# EAGLE design Board_1 (EAGLE 8.7.0)

## Sheet 1 of 3
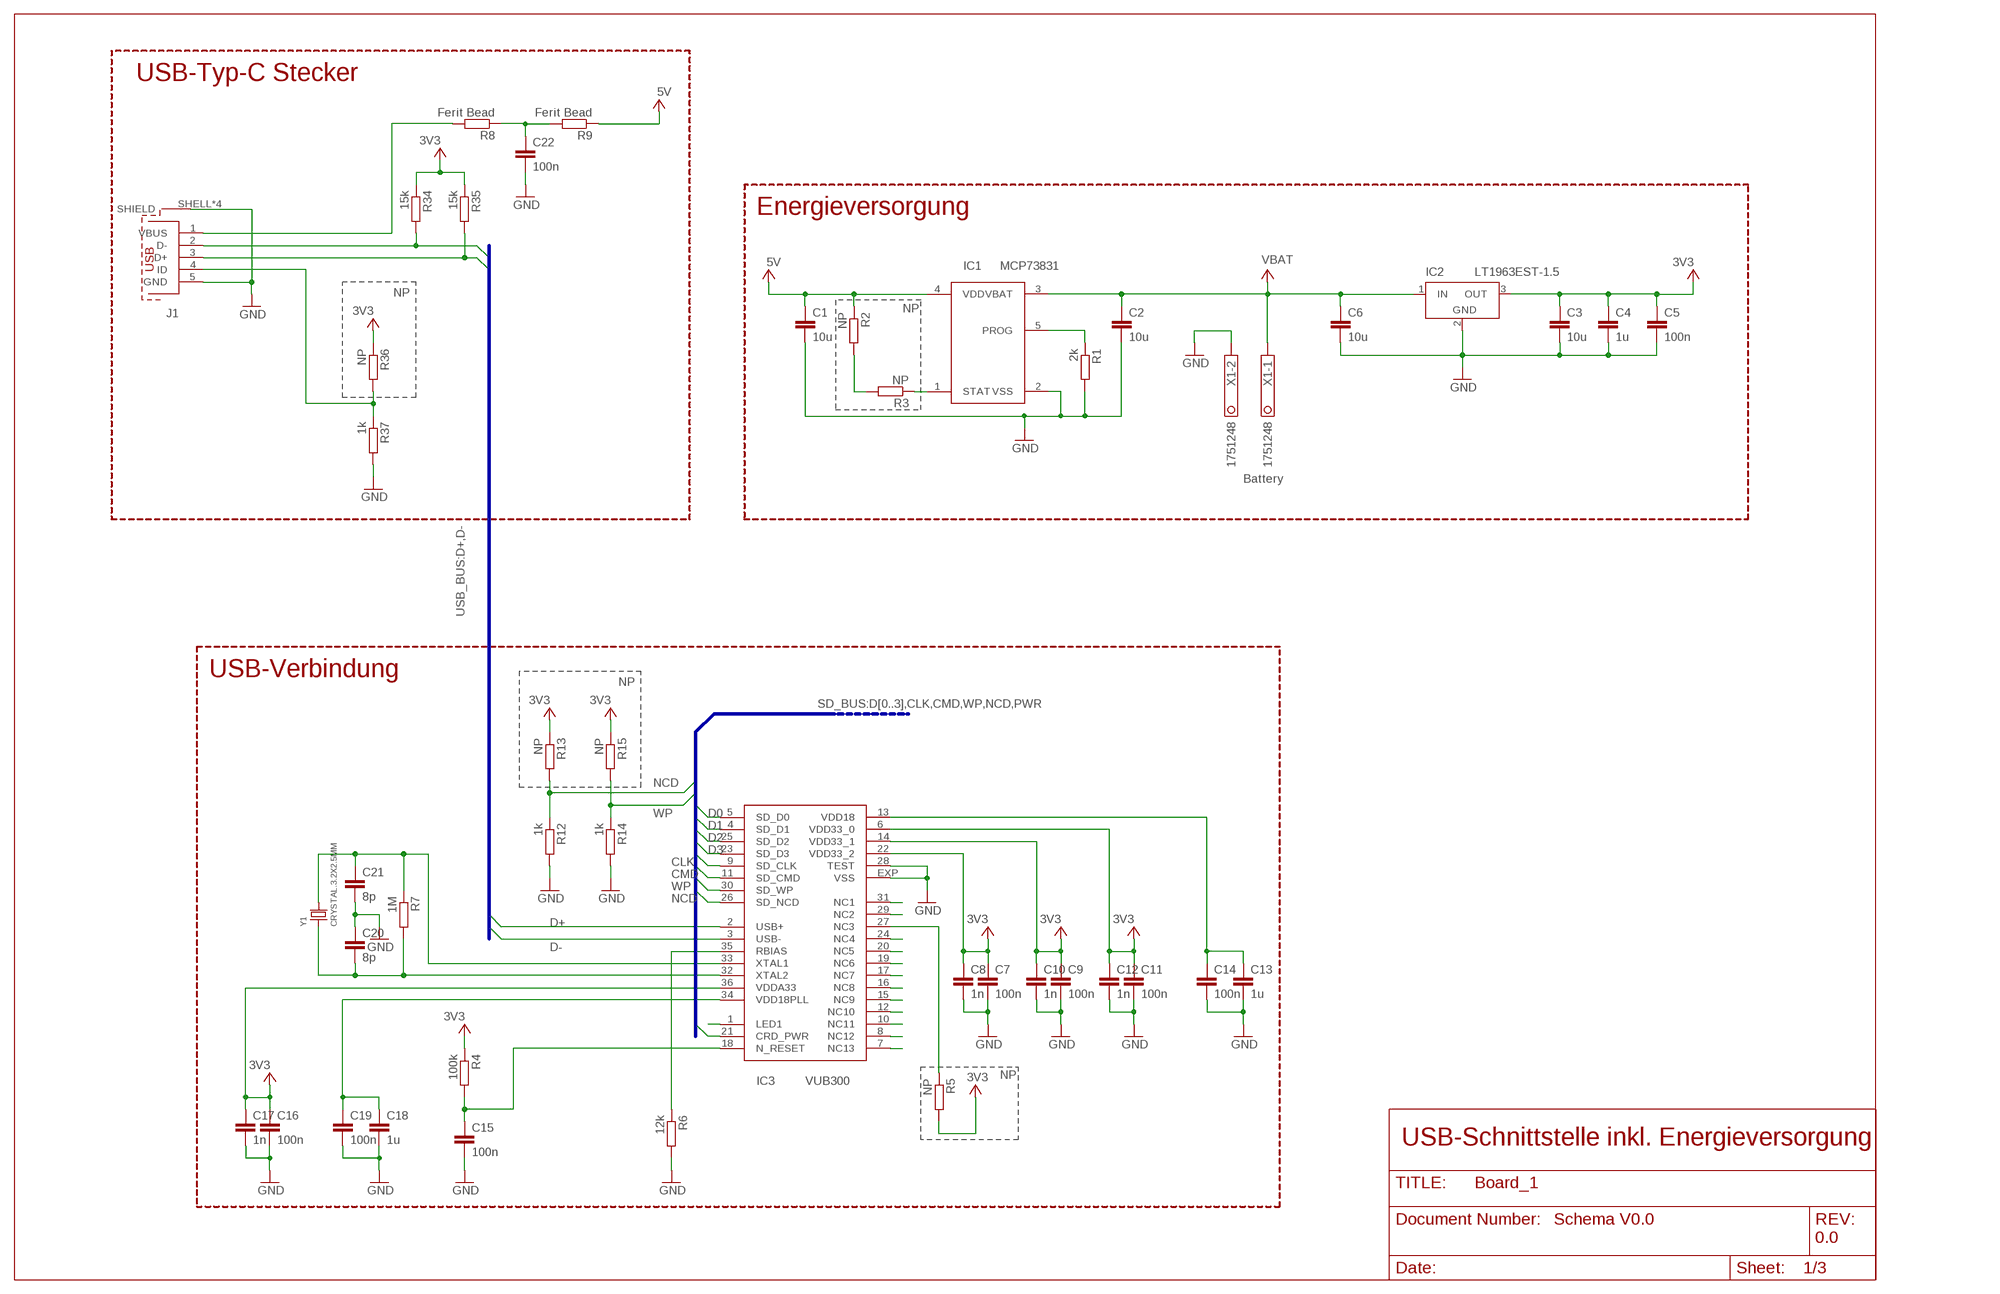
[diagram p0: schematic, sheet 1]

### Parts
C1  10u  C-EUC0805  [C0805]
C2  10u  C-EUC0805  [C0805]
C3  10u  C-EUC0805  [C0805]
C4  1u  C-EUC0603  [C0603]
C5  100n  C-EUC0603  [C0603]
C6  10u  C-EUC0805  [C0805]
C7  100n  C-EUC0402  [C0402]
C8  1n  C-EUC0402  [C0402]
C9  100n  C-EUC0402  [C0402]
C10  1n  C-EUC0402  [C0402]
C11  100n  C-EUC0402  [C0402]
C12  1n  C-EUC0402  [C0402]
C13  1u  C-EUC0402  [C0402]
C14  100n  C-EUC0402  [C0402]
C15  100n  C-EUC0402  [C0402]
C16  100n  C-EUC0402  [C0402]
C17  1n  C-EUC0402  [C0402]
C18  1u  C-EUC0402  [C0402]
C19  100n  C-EUC0402  [C0402]
C20  8p  C-EUC0402  [C0402]
C21  8p  C-EUC0402  [C0402]
C22  100n  C-EUC0603  [C0603]
IC1  MCP73831  [SOT23-5]
IC2  LT1963EST-1.5  [SOT223]
IC3  VUB300  [QFN36-6X6]
J1  629105136821  [629105136821]
R1  2k  R-EU_R0603  [R0603]
R2  NP  R-EU_R0603  [R0603]
R3  NP  R-EU_R0603  [R0603]
R4  100k  R-EU_R0402  [R0402]
R5  NP  R-EU_R0402  [R0402]
R6  12k  R-EU_R0402  [R0402]
R7  1M  R-EU_R0402  [R0402]
R8  Ferit Bead  R-EU_R0603  [R0603]
R9  Ferit Bead  R-EU_R0603  [R0603]
R12  1k  R-EU_R0603  [R0603]
R13  NP  R-EU_R0603  [R0603]
R14  1k  R-EU_R0603  [R0603]
R15  NP  R-EU_R0603  [R0603]
R34  15k  R-EU_R0402  [R0402]
R35  15k  R-EU_R0402  [R0402]
R36  NP  R-EU_R0603  [R0603]
R37  1k  R-EU_R0603  [R0603]
X1  1751248  [1751248]
Y1  CRYSTAL.3.2X2.5MM  [3.2X2.5MM]

### Nets
+3V3: C3.1 C4.1 C5.1 C7.1 C8.1 C9.1 C10.1 C11.1 C12.1 C16.1 C17.1 IC2.3(OUT) IC3.6(VDD33_0) IC3.14(VDD33_1) IC3.22(VDD33_2) IC3.36(VDDA33) R4.1 R5.2 R13.1 R15.1 R34.1 R35.1 R36.1 ; supply symbol labelled 3V3 ; also sheet 2,3
+5V: C1.1 IC1.4(VDD) R2.1 R9.1 ; supply symbol labelled 5V
CLK: IC3.9(SD_CLK) ; also sheet 2
CMD: IC3.11(SD_CMD) ; also sheet 2
D0: IC3.5(SD_D0) ; also sheet 2
D1: IC3.4(SD_D1) ; also sheet 2
D2: IC3.25(SD_D2) ; also sheet 2
D3: IC3.23(SD_D3) ; also sheet 2
D+: IC3.2(USB+) J1.3(D+) R35.2
D-: IC3.3(USB-) J1.2(D-) R34.2
GND: C1.2 C2.2 C3.2 C4.2 C5.2 C6.2 C7.2 C8.2 C9.2 C10.2 C11.2 C12.2 C13.2 C14.2 C15.2 C16.2 C17.2 C18.2 C19.2 C20.1 C21.2 C22.2 IC1.2(VSS) IC2.2(GND) IC3.28(TEST) IC3.EXP(VSS) J1.5(GND) J1.SHELL1(SHIELD) J1.SHELL2(SHIELD) J1.SHELL3(SHIELD) J1.SHELL(SHIELD) R1.2 R6.2 R12.2 R14.2 R37.2 X1.2 ; also sheet 2,3
N$1: IC1.5(PROG) R1.1
N$2: R2.2 R3.2
N$3: IC1.1(STAT) R3.1
N$4: IC3.1(LED1)
N$5: J1.4(ID) R36.2 R37.1
N$19: IC3.8(NC12)
N$20: IC3.7(NC13)
N$21: IC3.10(NC11)
N$22: IC3.12(NC10)
N$23: IC3.24(NC4)
N$24: IC3.15(NC9)
N$25: IC3.16(NC8)
N$26: IC3.17(NC7)
N$27: C15.1 IC3.18(N_RESET) R4.2
N$28: IC3.27(NC3) R5.1
N$29: IC3.19(NC6)
N$30: IC3.20(NC5)
N$31: IC3.35(RBIAS) R6.1
N$32: IC3.29(NC2)
N$33: IC3.31(NC1)
N$34: J1.1(VBUS) R8.2
N$35: C20.2 IC3.32(XTAL2) R7.2 Y1.1
N$36: C21.1 IC3.33(XTAL1) R7.1 Y1.3
N$37: C22.1 R8.1 R9.2
NCD: IC3.26(SD_NCD) R12.1 R13.2
PWR: IC3.21(CRD_PWR) ; also sheet 2
V+: C2.1 C6.1 IC1.3(VBAT) IC2.1(IN) X1.1 ; supply symbol labelled VBAT ; also sheet 3
VDD18: C13.1 C14.1 IC3.13(VDD18)
VDD18PLL: C18.1 C19.1 IC3.34(VDD18PLL)
WP: IC3.30(SD_WP) R14.1 R15.2

### Buses
SD_BUS:D[0..3],CLK,CMD,WP,NCD,PWR
USB_BUS:D+,D-

### Notes on the sheet
- USB-Typ-C Stecker
- Energieversorgung
- NP
- NP
- Battery
- USB-Verbindung | NP
- NP
- USB-Schnittstelle inkl. Energieversorgung
- Schema V0.0
- 0.0

## Sheet 2 of 3
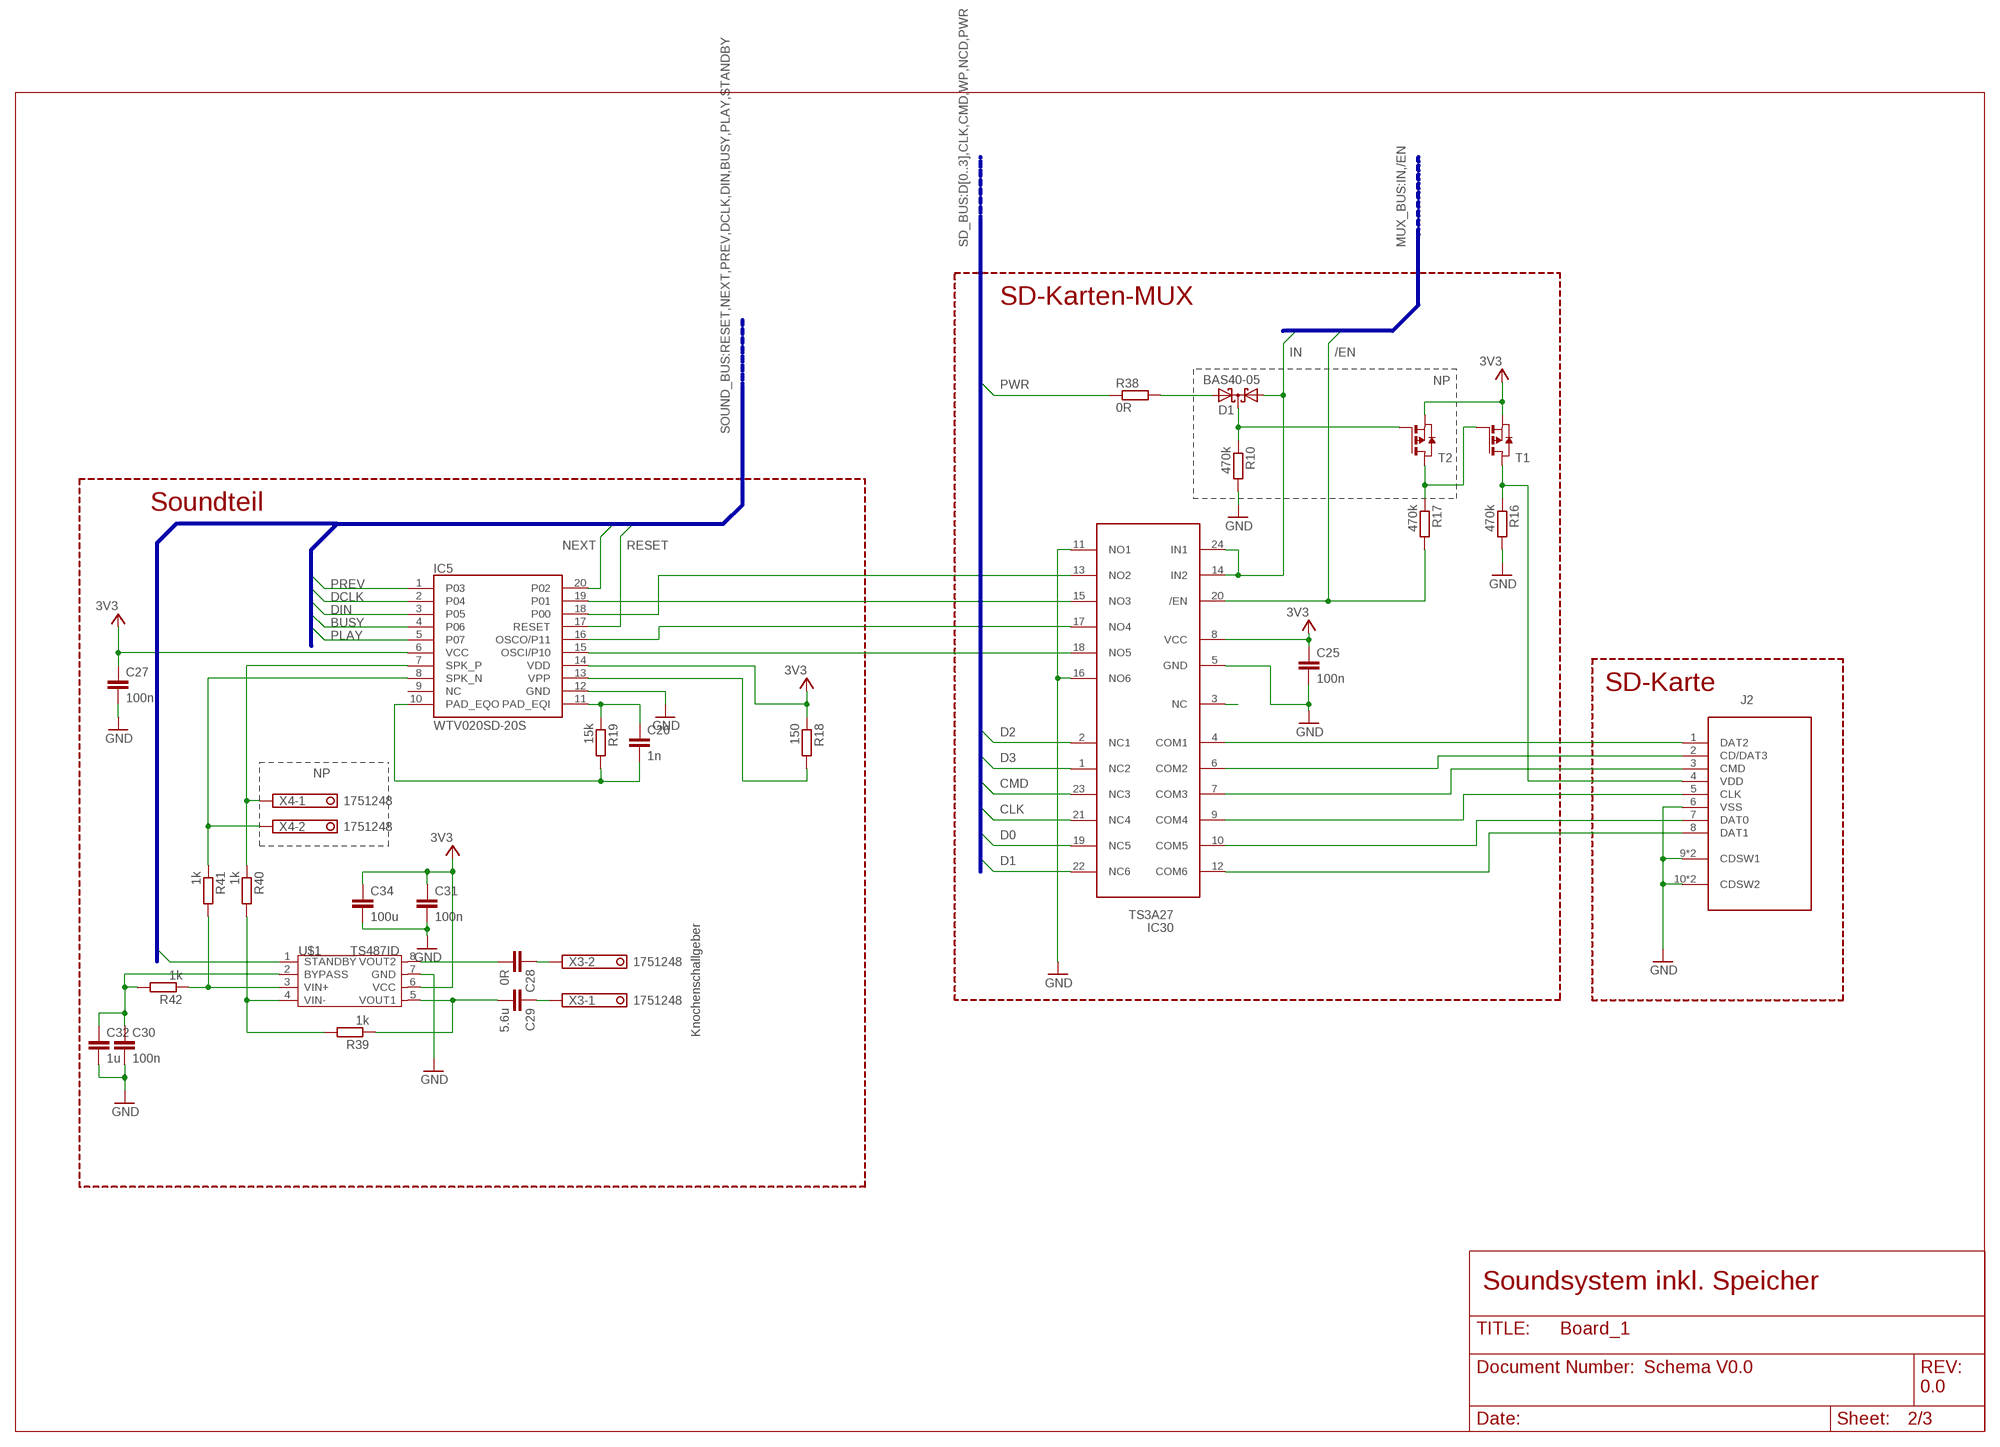
[diagram p1: schematic, sheet 2]

### Parts
C25  100n  C-EUC0603  [C0603]
C26  1n  C-EUC0603  [C0603]
C27  100n  C-EUC0603  [C0603]
C28  0R  C-EUC0603  [C0603]
C29  5.6u  C-EUC0603  [C0603]
C30  100n  C-EUC0603  [C0603]
C31  100n  C-EUC0603  [C0603]
C32  1u  C-EUC0805K  [C0805K]
C34  100u  C-EUC1206  [C1206]
D1  BAS40-05  [SOT23]
IC5  WTV020SD-20S  WTV020SD  [SSOP_20]
IC30  TS3A27  [TSSOP24]
J2  693071010811  [693071010811]
R10  470k  R-EU_R0603  [R0603]
R16  470k  R-EU_R0603  [R0603]
R17  470k  R-EU_R0603  [R0603]
R18  150  R-EU_R0603  [R0603]
R19  15k  R-EU_R0603  [R0603]
R38  0R  R-EU_MELF0102W  [MINI_MELF-0102W]
R39  1k  R-EU_R0603  [R0603]
R40  1k  R-EU_R0603  [R0603]
R41  1k  R-EU_R0603  [R0603]
R42  1k  R-EU_R0603  [R0603]
T1  PMOSSOT23  [SOT-23]
T2  PMOSSOT23  [SOT-23]
U$1  TS487ID  TS4890D  [SO08-6.0]
X3  1751248  [1751248]
X4  1751248  [1751248]

### Nets
+3V3: C25.1 C27.1 C31.1 C34.1 IC5.6(VCC) IC5.14(VDD) IC30.8(VCC) R18.1 T1.2(S) T2.2(S) U$1.6(VCC) ; supply symbol labelled 3V3 ; also sheet 1,3
/EN: IC30.20(/EN) R17.2 ; also sheet 3
BUSY: IC5.4(P06) ; also sheet 3
CLK: IC30.21(NC4) ; also sheet 1
CMD: IC30.23(NC3) ; also sheet 1
D0: IC30.19(NC5) ; also sheet 1
D1: IC30.22(NC6) ; also sheet 1
D2: IC30.2(NC1) ; also sheet 1
D3: IC30.1(NC2) ; also sheet 1
DCLK: IC5.2(P04) ; also sheet 3
DIN: IC5.3(P05) ; also sheet 3
GND: C25.2 C27.2 C30.2 C31.2 C32.2 C34.2 IC5.12(GND) IC30.5(GND) IC30.11(NO1) IC30.16(NO6) J2.6(VSS) J2.9(CDSW1) J2.9-1(CDSW1) J2.10(CDSW2) J2.10-1(CDSW2) R10.2 R16.2 U$1.7(GND) ; also sheet 1,3
IN: D1.1(A1) IC30.14(IN2) IC30.24(IN1) ; also sheet 3
N$8: D1.2(A2) R38.2
N$9: IC5.19(P01) IC30.15(NO3)
N$10: C28.1 X3.2
N$11: C28.2 U$1.8(VOUT2)
N$12: C29.2 R39.1 U$1.5(VOUT1)
N$13: C30.1 C32.1 R42.2 U$1.2(BYPASS)
N$14: R39.2 R40.2 U$1.4(VIN-)
N$15: R41.2 R42.1 U$1.3(VIN+)
N$16: C29.1 X3.1
N$38: IC30.9(COM4) J2.5(CLK)
N$39: IC5.13(VPP) R18.2
N$40: C26.1 IC5.11(PAD_EQI) R19.1
N$41: IC5.16(OSCO/P11) IC30.17(NO4)
N$42: IC5.15(OSCI/P10) IC30.18(NO5)
N$43: IC30.4(COM1) J2.1(DAT2)
N$44: IC30.12(COM6) J2.8(DAT1)
N$45: IC30.6(COM2) J2.2(CD/DAT3)
N$46: R17.1 T1.3(G) T2.1(D)
N$47: IC30.3(NC)
N$49: D1.3(C) R10.1 T2.3(G)
NCD1: J2.4(VDD) R16.1 T1.1(D)
NEXT: IC5.20(P02) ; also sheet 3
PLAY: IC5.5(P07) ; also sheet 3
PREV: IC5.1(P03) ; also sheet 3
PWM: C26.2 IC5.10(PAD_EQO) R19.2
PWR: R38.1 ; also sheet 1
RESET: IC5.17(RESET) ; also sheet 3
SDCS: IC5.18(P00) IC30.13(NO2)
SDDI: IC30.7(COM3) J2.3(CMD)
SDDO: IC30.10(COM5) J2.7(DAT0)
SPK+: IC5.7(SPK_P) R40.1 X4.1
SPK-: IC5.8(SPK_N) R41.1 X4.2
STANDBY: U$1.1(!STANDBY) ; also sheet 3
Unconnected: IC5.9(NC)

### Buses
SD_BUS:D[0..3],CLK,CMD,WP,NCD,PWR
MUX_BUS:IN,/EN
SOUND_BUS:RESET,NEXT,PREV,DCLK,DIN,BUSY,PLAY,STANDBY

### Notes on the sheet
- SD-Karten-MUX
- NP
- Soundteil
- SD-Karte
- NP
- Knochenschallgeber
- Soundsystem inkl. Speicher
- Schema V0.0
- 0.0

## Sheet 3 of 3
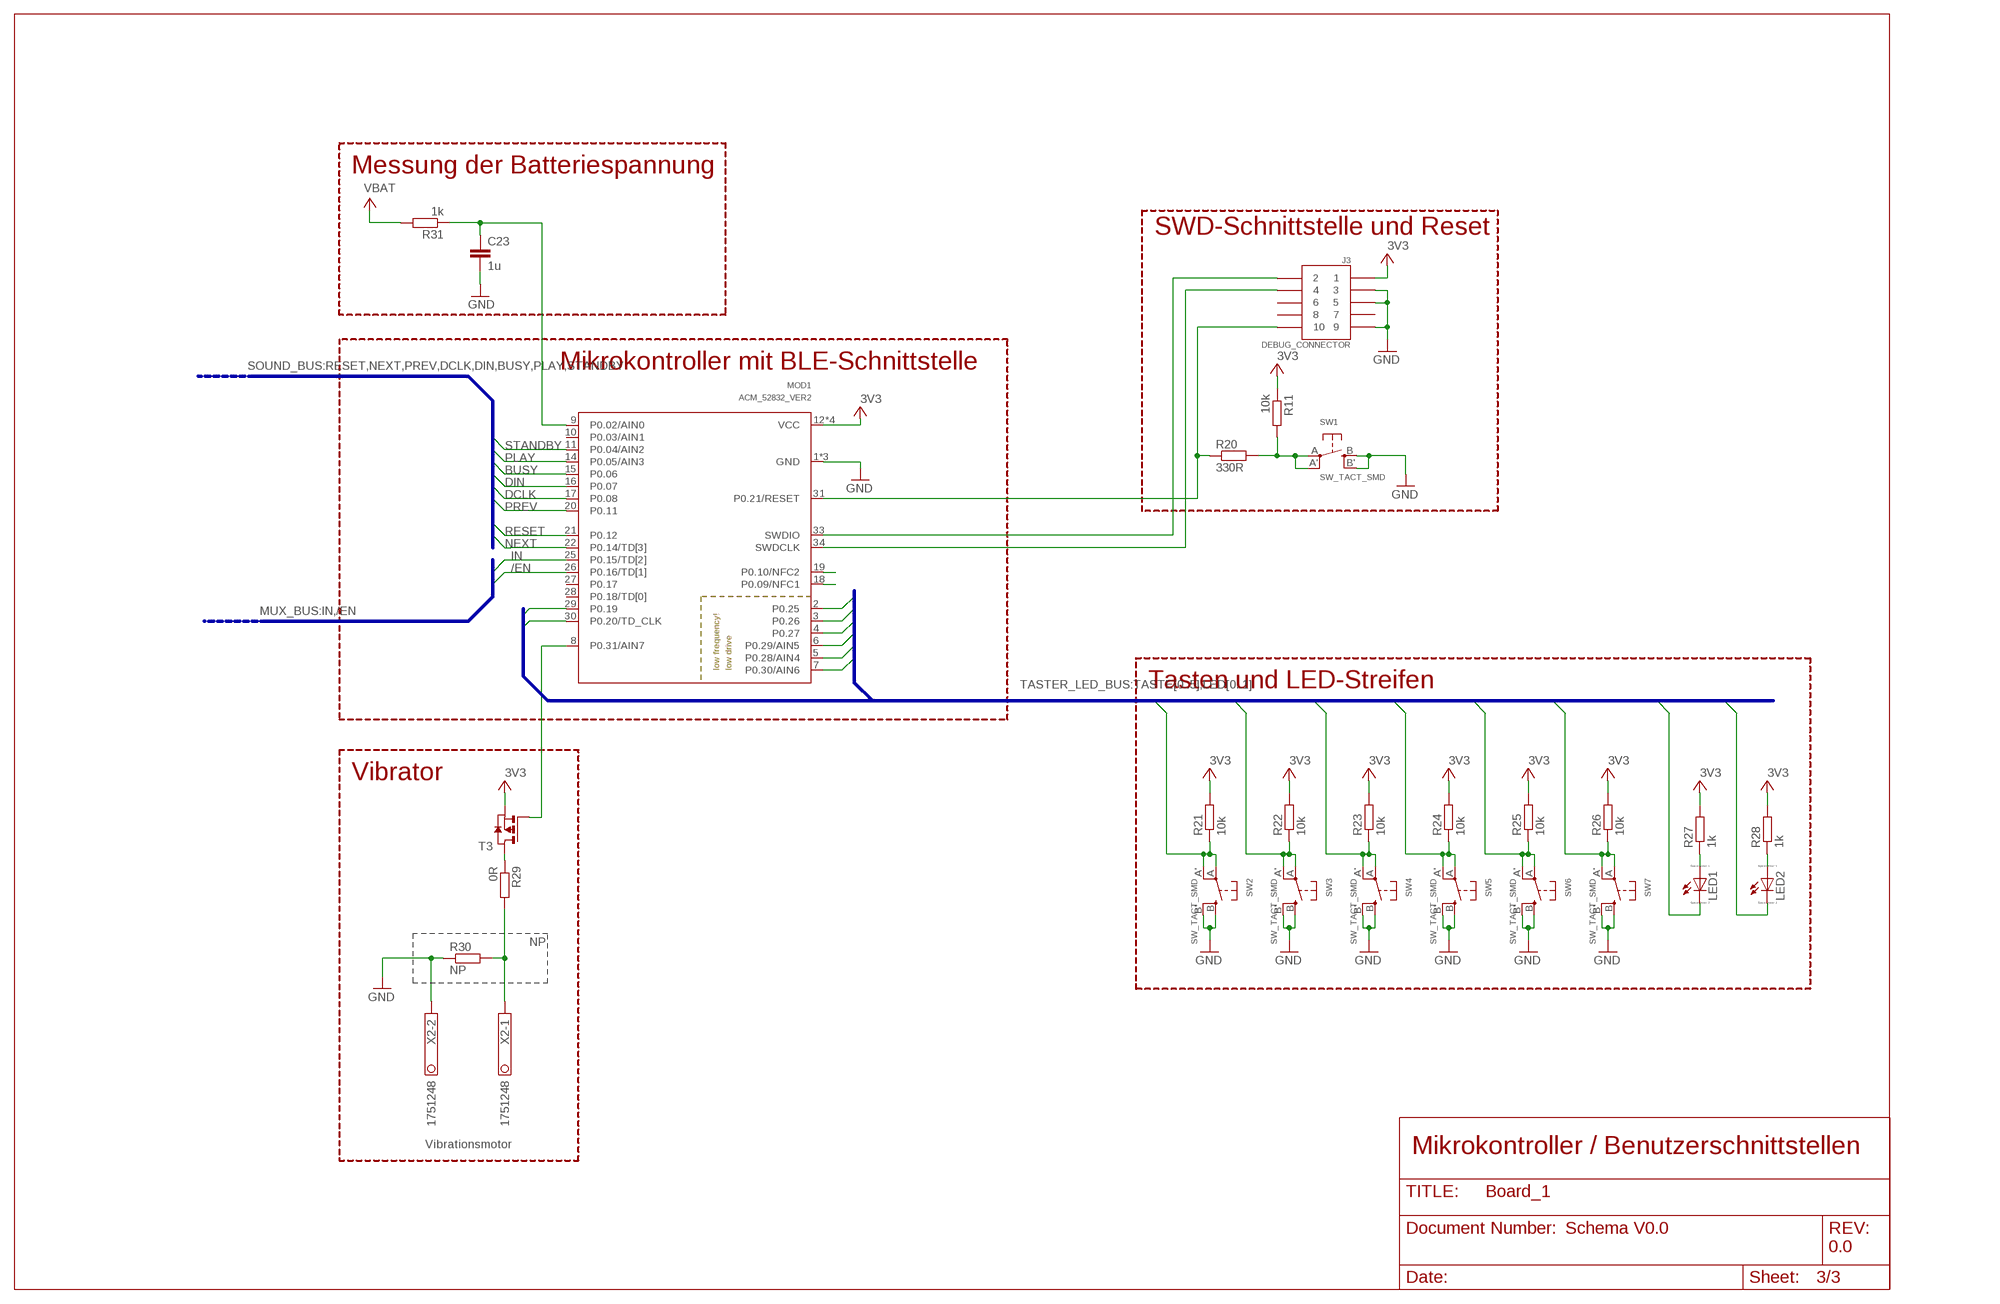
[diagram p2: schematic, sheet 3]

### Parts
C23  1u  C-EUC0603  [C0603]
J3  DEBUG_CONNECTOR  [HDRV127P5X2-10_N]
LED1  LED_E  [LED_1206]
LED2  LED_E  [LED_1206]
MOD1  ACM_52832_VER2  [ACONNO_ACM_52832]
R11  10k  R-EU_R0603  [R0603]
R20  330R  R-EU_R0603  [R0603]
R21  10k  R-EU_R0603  [R0603]
R22  10k  R-EU_R0603  [R0603]
R23  10k  R-EU_R0603  [R0603]
R24  10k  R-EU_R0603  [R0603]
R25  10k  R-EU_R0603  [R0603]
R26  10k  R-EU_R0603  [R0603]
R27  1k  R-EU_R0603  [R0603]
R28  1k  R-EU_R0603  [R0603]
R29  0R  R-EU_R0603  [R0603]
R30  NP  R-EU_R0603  [R0603]
R31  1k  R-EU_R0603  [R0603]
SW1  SW_TACT_SMD  [EVQ-Q2]
SW2  SW_TACT_SMD  [EVQ-Q2]
SW3  SW_TACT_SMD  [EVQ-Q2]
SW4  SW_TACT_SMD  [EVQ-Q2]
SW5  SW_TACT_SMD  [EVQ-Q2]
SW6  SW_TACT_SMD  [EVQ-Q2]
SW7  SW_TACT_SMD  [EVQ-Q2]
T3  PMOSSOT23  [SOT-23]
X2  1751248  [1751248]

### Nets
+3V3: J3.1 MOD1.12(VCC) MOD1.23(VCC) MOD1.24(VCC) MOD1.32(VCC) R11.1 R21.2 R22.2 R23.2 R24.2 R25.2 R26.2 R27.2 R28.2 T3.2(S) ; supply symbol labelled 3V3 ; also sheet 1,2
/EN: MOD1.26(P0.16/TD[1]) ; also sheet 2
BUSY: MOD1.15(P0.06) ; also sheet 2
DCLK: MOD1.17(P0.08) ; also sheet 2
DIN: MOD1.16(P0.07) ; also sheet 2
GND: C23.2 J3.3 J3.5 J3.9 MOD1.1(GND) MOD1.13(GND) MOD1.35(GND) R30.1 SW1.B'(S1) SW1.B(S) SW2.B'(S1) SW2.B(S) SW3.B'(S1) SW3.B(S) SW4.B'(S1) SW4.B(S) SW5.B'(S1) SW5.B(S) SW6.B'(S1) SW6.B(S) SW7.B'(S1) SW7.B(S) X2.2 ; also sheet 1,2
IN: MOD1.25(P0.15/TD[2]) ; also sheet 2
LED0: LED1.C MOD1.29(P0.19)
LED1: LED2.C MOD1.30(P0.20/TD_CLK)
N$6: MOD1.19(P0.10/NFC2)
N$7: MOD1.18(P0.09/NFC1)
N$48: R11.2 R20.2 SW1.A'(P1) SW1.A(P)
N$50: J3.4 MOD1.34(SWDCLK)
N$52: J3.10 MOD1.31(P0.21/RESET) R20.1
N$53: J3.2 MOD1.33(SWDIO)
N$54: LED1.A R27.1
N$55: C23.1 MOD1.9(P0.02/AIN0) R31.1
N$61: LED2.A R28.1
N$63: R29.2 R30.2 X2.1
N$64: MOD1.8(P0.31/AIN7) T3.3(G)
N$65: R29.1 T3.1(D)
NEXT: MOD1.22(P0.14/TD[3]) ; also sheet 2
PLAY: MOD1.14(P0.05/AIN3) ; also sheet 2
PREV: MOD1.20(P0.11) ; also sheet 2
RESET: MOD1.21(P0.12) ; also sheet 2
STANDBY: MOD1.11(P0.04/AIN2) ; also sheet 2
TASTE0: MOD1.7(P0.30/AIN6) R21.1 SW2.A'(P1) SW2.A(P)
TASTE1: MOD1.5(P0.28/AIN4) R22.1 SW3.A'(P1) SW3.A(P)
TASTE2: MOD1.6(P0.29/AIN5) R23.1 SW4.A'(P1) SW4.A(P)
TASTE3: MOD1.4(P0.27) R24.1 SW5.A'(P1) SW5.A(P)
TASTE4: MOD1.3(P0.26) R25.1 SW6.A'(P1) SW6.A(P)
TASTE5: MOD1.2(P0.25) R26.1 SW7.A'(P1) SW7.A(P)
V+: R31.2 ; supply symbol labelled VBAT ; also sheet 1
Unconnected: J3.6 J3.7 J3.8 MOD1.10(P0.03/AIN1) MOD1.27(P0.17) MOD1.28(P0.18/TD[0])

### Buses
SOUND_BUS:RESET,NEXT,PREV,DCLK,DIN,BUSY,PLAY,STANDBY
MUX_BUS:IN,/EN
TASTER_LED_BUS:TASTE[0..5],LED[0..1]

### Notes on the sheet
- Messung der Batteriespannung
- SWD-Schnittstelle und Reset
- Mikrokontroller mit BLE-Schnittstelle
- Tasten und LED-Streifen
- Vibrator
- NP
- Vibrationsmotor
- Mikrokontroller / Benutzerschnittstellen
- Schema V0.0
- 0.0

## Power pins joined to a net without a drawn wire
GND: IC2.4(GND)

## Library data of the parts
C1-C23 C25-C32 C34 = rcl:C-EU: CAPACITOR, European symbol; SPICEPREFIX: C
D1 = diode:BAS40-05: Silicon Schottky Diodes General-purpose diode for high-speed switching
IC1 = mcp73831:MCP73831
IC2 = linear-technology:LT1963EST: 1.5A, Low Noise, Fast Transient Response LDO Regulator Source: http://www.linear.com/pc/downloadDocument.do?navId=H0,C3,P2222,D3148; MPN: LT1963EST-1.5; OC_FARNELL: 1663528; OC_NEWARK: 57M7534
IC3 = VUB300:VUB300
IC5 = SparkFun-DigitalIC:WTV020SD: SD audio playback IC Can play back .wav or .ad4 files from an SD card SPI control or digital input trigger control available in SSOP-20 or DIP-20; PROD_#: NA; PROD_ID: IC-11012; SKU: NA; SPARKLE_ID: 6000
IC30 = TS3a27:TS3A27
J1 = USBZueg:629105136821: WR-COM SMT Horizontal 5 Contacts Micro USB Type B,5 pins=>Code : Con_I-O_COM_MicroUSB_629105136821 <http://katalog.we-online.de/media/images/eican/Con_I-O_COM_MicroUSB_629105136821_pf2.jpg> Details see: http://katalog.we-online.de/en/em/COM_MICRO_SMT_TYPE_B_HORIZONTAL/629105136821?m Created 2014-07-09, Karrer Zheng 2014 (C) Würth Elektronik
J2 = InputOutputIO (rev18a)(1):693071010811: WR-CRD MICRO SD CARD CONNECTOR PUSH & PUSH WITH CARD DETECTION 8PINS=>Code : Con_I-O_COM_CRD_SD_Micro_693071010811 <http://katalog.we-online.de/media/images/eican/Con_I-O_COM_CRD_SD_Micro_693071010811_pf2.jpg> Details see: http://katalog.we-online.de/en/em/CRD_SD_MICRO_PUSH_AND_PULL_8_PINS/693071010811 Created 2014-07-09, Karrer Zheng 2014 (C) Würth Elektronik
J3 = Nordic_misc:DEBUG_CONNECTOR
LED1 LED2 = eagle-ltspice:LED_E: LED Source: http://www.osram.convergy.de Source: www.luxeon.com Source: www.kingbright.com; SPICEMODEL: NONE; SPICEPREFIX: D; SPICETYPE: diode
MOD1 = acn52832_eagle:ACM_52832_VER2: Aconno BLE 2,4 GHz Module nRF52832 based
R1-R31 R34-R42 = resistor:R-EU_: RESISTOR, European symbol
SW1-SW7 = Pro3E:SW_TACT_SMD
T1-T3 = zetex:PMOSSOT23: MOS FET; OC_FARNELL: unknown; OC_NEWARK: unknown
U$1 = TI_IC:TS4890: Rail To Rail OUTPUT 1W Audio Power Amplifier With Standby Mode Active Low http://www.alldatasheet.com/datasheet-pdf/pdf/25462/STMICROELECTRONICS/TS4890.html
X1-X4 = con-phoenix-350:1751248: MKDS 1/ 2-3,5 Printklemme Nennstrom: 10 A Bemessungsspannung: 160 V Raster: 3,5 mm Polzahl: 2 Montageart: Löten Anschlussart: Schraubanschluss Anschlussrichtung vom Leiter zur Platine: 0° Source: http://eshop.phoenixcontact.com .. 1751248.pdf; OC_FARNELL: unknown; OC_NEWARK: unknown
Y1 = abracom:CRYSTAL

## Board
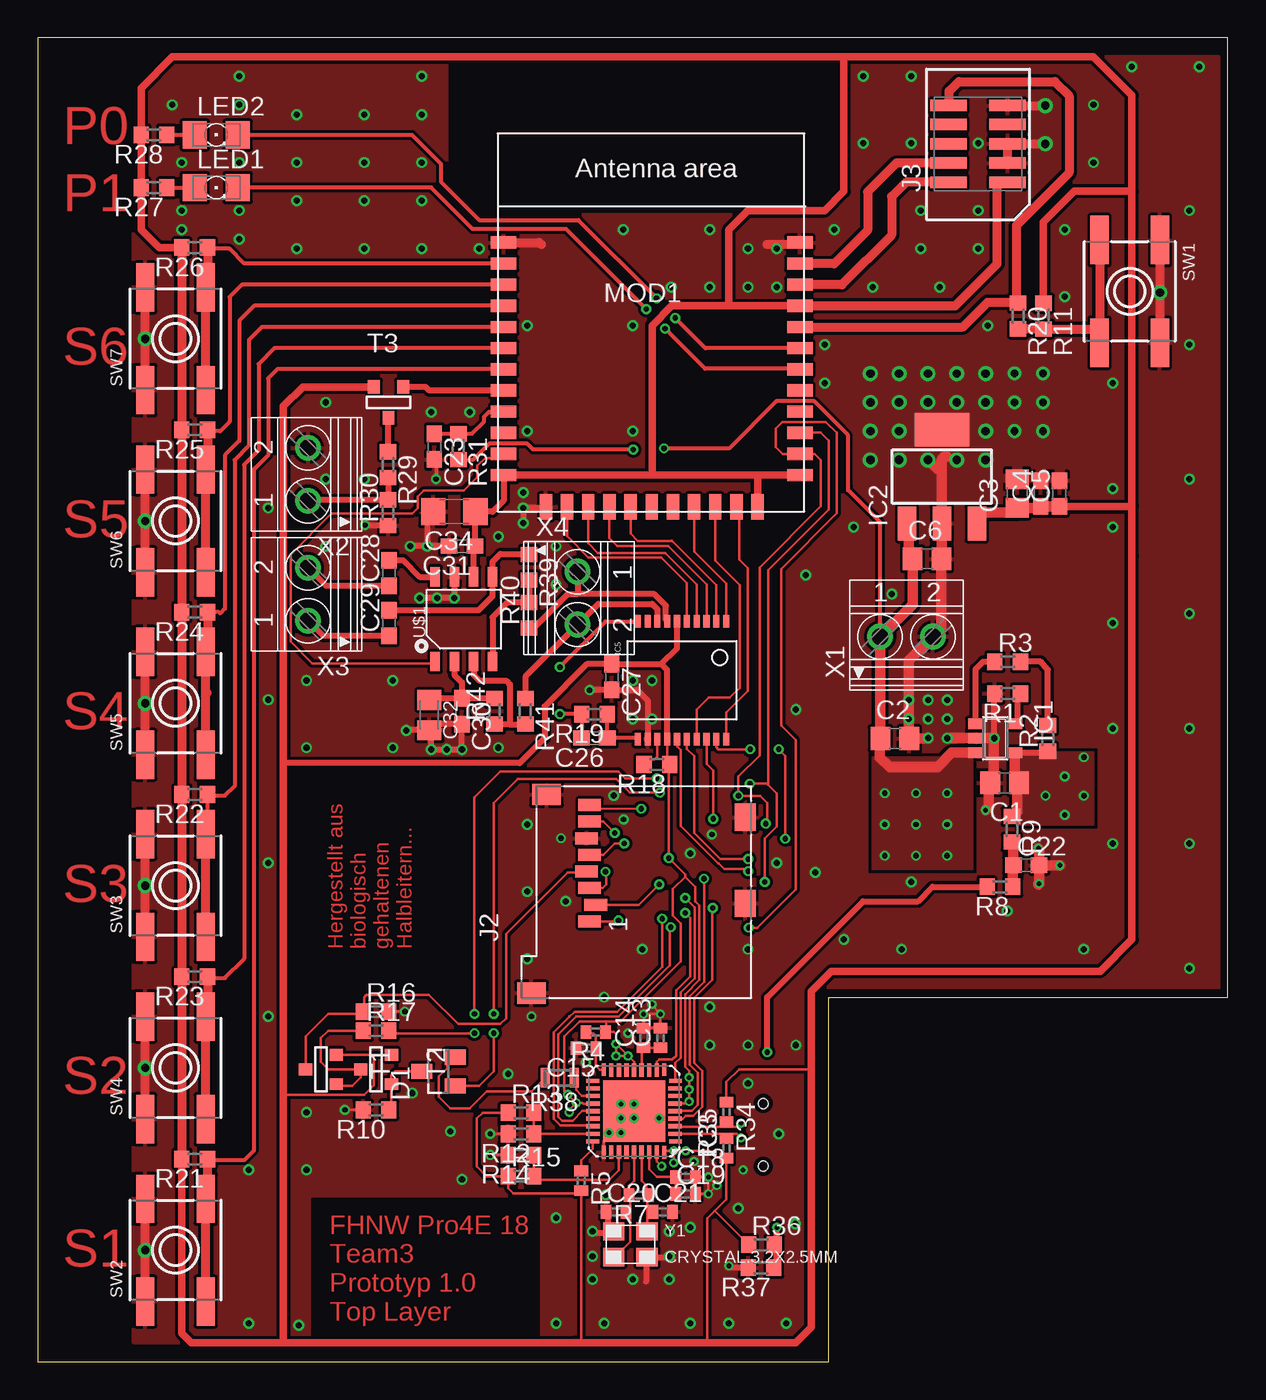
[diagram p3: board, top side]
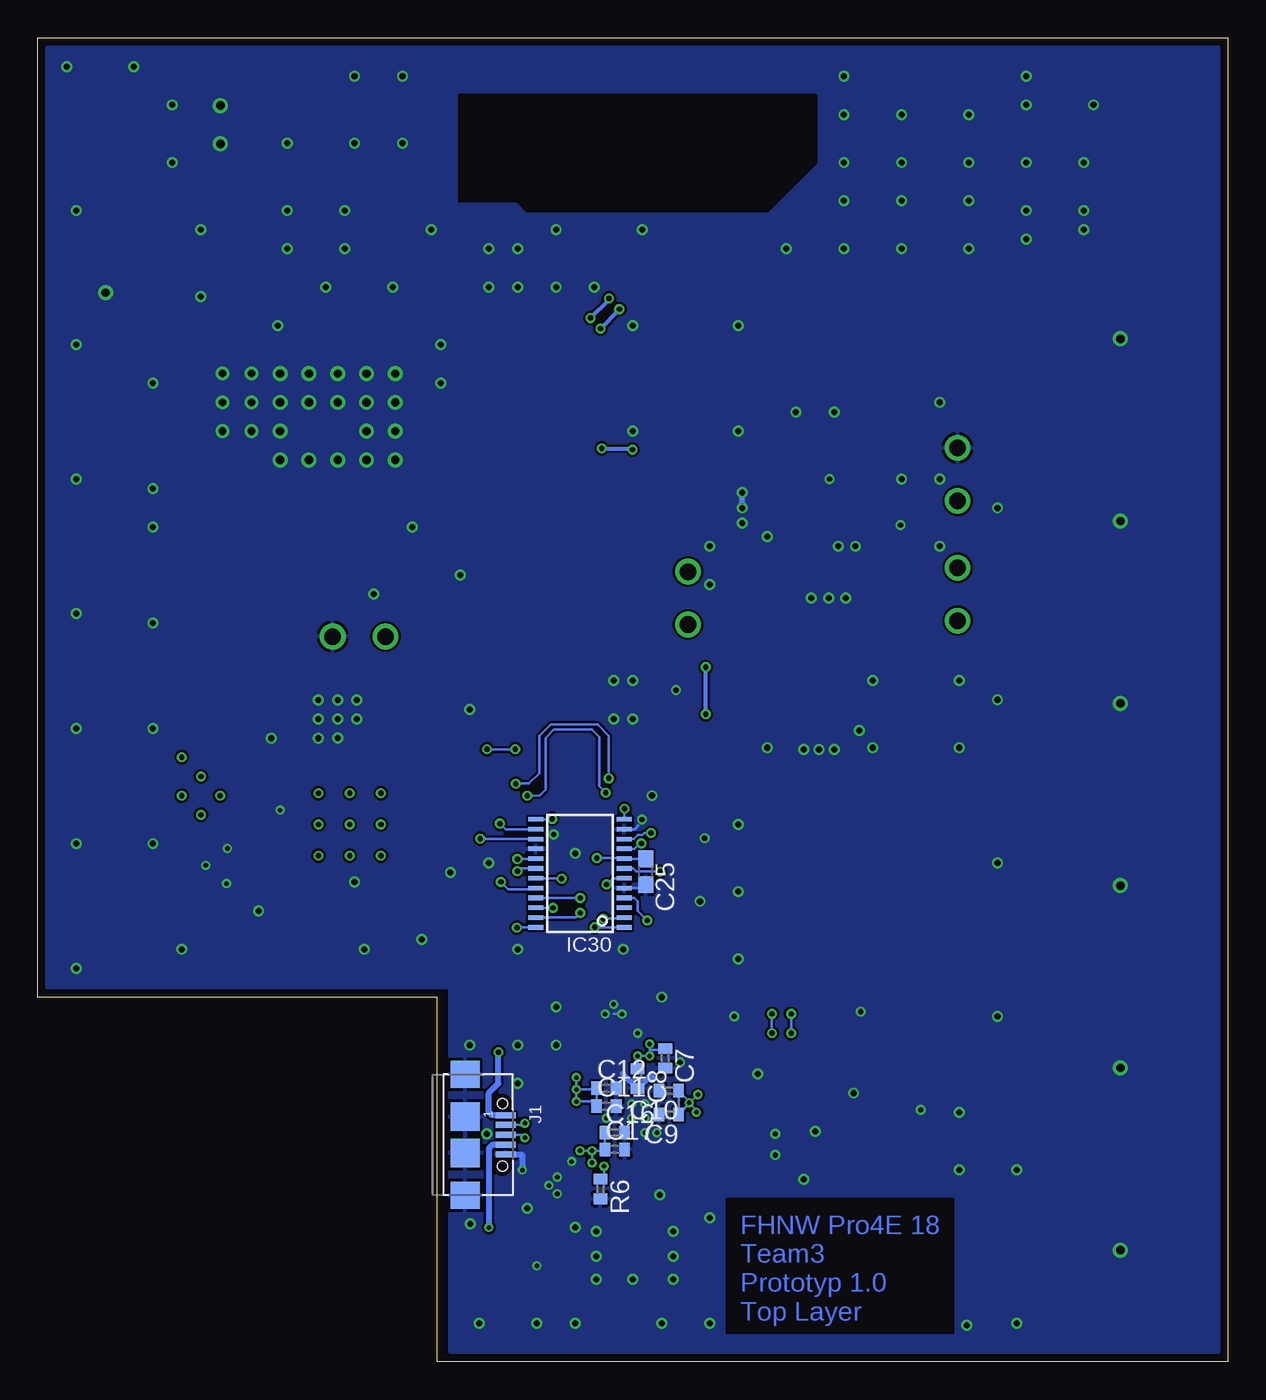
[diagram p4: board, bottom side, seen from below]

Size 78.74 x 87.63 mm. Coordinates in mm from the lower left corner, seen from the top.
Outline: 0,0 52.32,0 52.32,24.13 78.74,24.13 78.74,87.63 0,87.63 0,0
Copper layers (1*16): Top 0.035mm / dielectric 1.5mm / Bottom 0.035mm
Design rules "PCB-POOL Standard": minimum track width 0.15mm, minimum drill 0.3mm, track to track 0.15mm, track to pad 0.15mm, pad to pad 0.15mm, via to via 0.15mm, smd to smd 0.15mm, copper to edge 0.3mm, drill to drill 0.2mm, minimum pad ring 0.2mm, minimum via ring 0.15mm, stop-mask expansion 0.075mm, vias tented up to drill 0mil, thermal gap 0.2mm

### Footprints (pad centres in the part's own frame; a part is rotated, then mirrored left to right if it is on the bottom)
C0805 = smd 1.3 x 1.5: 1 -0.95,0; 2 0.95,0
C0603 = smd 1.1 x 1: 1 -0.85,0; 2 0.85,0
C0402 = smd 0.7 x 0.9: 1 -0.65,0; 2 0.65,0
C0805K = smd 1.3 x 1.6: 1 -1,0; 2 1,0
C1206 = smd 1.6 x 1.8: 1 -1.4,0; 2 1.4,0
SOT23 = smd 1 x 1.4: 1 -0.95,-1.1; 2 0.95,-1.1; 3 0,1.1
SOT23-5 = smd 0.69 x 0.99: 1 -0.95,-1.29; 2 0,-1.29; 3 0.95,-1.29; 4 0.95,1.3; 5 -0.95,1.3
SOT223 = smd 1.219 x 2.235: 1 -2.311,-3.099; 2 0,-3.099; 3 2.311,-3.099 | smd 3.6 x 2.2: 4 0,3.099
QFN36-6X6 = smd 0.28 x 0.84: 1 -2,-2.735; 9 2,-2.735; 19 2,2.735; 27 -2,2.735 | smd 0.28 x 0.89: 2 -1.5,-2.71; 3 -1,-2.71; 4 -0.5,-2.71; 5 0,-2.71; 6 0.5,-2.71; 7 1,-2.71; 8 1.5,-2.71; 20 1.5,2.71; 21 1,2.71; 22 0.5,2.71; 23 0,2.71; 24 -0.5,2.71; 25 -1,2.71; 26 -1.5,2.71 | smd 0.84 x 0.28: 10 2.735,-2; 18 2.735,2; 28 -2.735,2; 36 -2.735,-2 | smd 0.89 x 0.28: 11 2.71,-1.5; 12 2.71,-1; 13 2.71,-0.5; 14 2.71,0; 15 2.71,0.5; 16 2.71,1; 17 2.71,1.5; 29 -2.71,1.5; 30 -2.71,1; 31 -2.71,0.5; 32 -2.71,0; 33 -2.71,-0.5; 34 -2.71,-1; 35 -2.71,-1.5 | smd 4.1 x 4.1: EXP 0,0
SSOP_20 = smd 0.813 x 0.406: 1 -3.9,2.925; 2 -3.9,2.275; 3 -3.9,1.625; 4 -3.9,0.975; 5 -3.9,0.325; 6 -3.9,-0.325; 7 -3.9,-0.975; 8 -3.9,-1.625; 9 -3.9,-2.275; 10 -3.9,-2.925; 11 3.9,-2.925; 12 3.9,-2.275; 13 3.9,-1.625; 14 3.9,-0.975; 15 3.9,-0.325; 16 3.9,0.325; 17 3.9,0.975; 18 3.9,1.625; 19 3.9,2.275; 20 3.9,2.925
TSSOP24 = smd 0.305 x 0.991: 1 -3.575,-2.918; 2 -2.925,-2.918; 3 -2.275,-2.918; 4 -1.625,-2.918; 5 -0.975,-2.918; 6 -0.325,-2.918; 7 0.325,-2.918; 8 0.975,-2.918; 9 1.625,-2.918; 10 2.275,-2.918; 11 2.925,-2.918; 12 3.575,-2.918; 13 3.575,2.918; 14 2.925,2.918; 15 2.275,2.918; 16 1.625,2.918; 17 0.975,2.918; 18 0.325,2.918; 19 -0.325,2.918; 20 -0.975,2.918; 21 -1.625,2.918; 22 -2.275,2.918; 23 -2.925,2.918; 24 -3.575,2.918
629105136821 = smd 0.4 x 1.35: 1 -1.3,2.675; 2 -0.65,2.675; 3 0,2.675; 4 0.65,2.675; 5 1.3,2.675 | smd 1.8 x 1.9: SHELL -4,0; SHELL3 4,0 | smd 1.9 x 1.9: SHELL1 -1.2,0; SHELL2 1.2,0 | hole 0.65: -2.075,2.45; 2.075,2.45
693071010811 = smd 0.8 x 1.5: 1 0,0; 2 1.1,-0.4; 3 2.2,0; 4 3.3,0.2; 5 4.4,0; 6 5.5,0.2; 7 6.6,0; 8 7.7,0 | smd 1.4 x 1.9: 9 -4.75,3.85; 9-1 8.4,2.85 | smd 1.8 x 1.4: 10 1.19,-10.3; 10-1 6.89,-10.3
HDRV127P5X2-10_N = smd 0.76 x 2.4: 1 -2.54,-1.95; 2 -2.54,1.95; 3 -1.27,-1.95; 4 -1.27,1.95; 5 0,-1.95; 6 0,1.95; 7 1.27,-1.95; 8 1.27,1.95; 9 2.54,-1.95; 10 2.54,1.95
LED_1206 = smd 1.6 x 1.803: A -1.422,0; C 1.422,0
ACONNO_ACM_52832 = smd 1.676 x 0.813: 1 -9.8,8.4; 2 -9.8,7; 3 -9.8,5.6; 4 -9.8,4.2; 5 -9.8,2.8; 6 -9.8,1.4; 7 -9.8,0; 8 -9.8,-1.4; 9 -9.8,-2.8; 10 -9.8,-4.2; 11 -9.8,-5.6; 12 -9.8,-7; 24 9.8,-7; 25 9.8,-5.6; 26 9.8,-4.2; 27 9.8,-2.8; 28 9.8,-1.4; 29 9.8,0; 30 9.8,1.4; 31 9.8,2.8; 32 9.8,4.2; 33 9.8,5.6; 34 9.8,7; 35 9.8,8.4 | smd 0.813 x 1.676: 13 -7,-9.1; 14 -5.6,-9.1; 15 -4.2,-9.1; 16 -2.8,-9.1; 17 -1.4,-9.1; 18 0,-9.1; 19 1.4,-9.1; 20 2.8,-9.1; 21 4.2,-9.1; 22 5.6,-9.1; 23 7,-9.1
R0603 = smd 1 x 1.1: 1 -0.85,0; 2 0.85,0
R0402 = smd 0.7 x 0.9: 1 -0.65,0; 2 0.65,0
MINI_MELF-0102W = smd 0.6 x 1.3: 1 -0.95,0; 2 0.95,0
EVQ-Q2 = smd 3.2 x 1.2: A -3.4,-2; A' 3.4,-2; B -3.4,2; B' 3.4,2
SOT-23 = smd 0.787 x 0.889: 1 0.025,-1.016; 2 -0.94,1.016; 3 0.991,1.016
SO08-6.0 = smd 0.635 x 1.27: 1 -1.905,-2.8; 2 -0.635,-2.8; 3 0.635,-2.8; 4 1.905,-2.8; 5 1.905,2.8; 6 0.635,2.8; 7 -0.635,2.8; 8 -1.905,2.8
1751248 = drill 1.1 pad 1.7: 1 -1.75,-0.1; 2 1.75,-0.1
3.2X2.5MM = smd 1.4 x 1.2: 1 -1.1,-0.85; 2 1.1,-0.85; 3 1.1,0.85; 4 -1.1,0.85

### Placement (x,y rotation side)
C1  63.97,38.32 180 top
C2  56.71,41.26 0 top
C3  64.8,57.46 90 top
C4  66.36,57.46 90 top
C5  67.6,57.46 90 top
C6  58.83,53.14 0 top
C7  37.23,20.08 270 bottom
C8  39.05,18.73 270 bottom
C9  36.99,16.35 180 bottom
C10  36.99,17.94 180 bottom
C11  41.12,16.91 0 bottom
C12  41.12,18.1 0 bottom
C13  41.2,21.43 90 top
C14  40.08,21.43 90 top
C15  36.27,20.76 180 top
C16  40.56,15.16 0 bottom
C17  40.56,14.05 0 bottom
C18  42.86,12.22 0 top
C19  42.86,11.11 0 top
C20  38.26,9.92 0 top
C21  41.35,9.92 0 top
C22  65.4,32.86 0 top
C23  26.24,60.57 270 top
C25  38.53,32.43 270 bottom
C26  36.83,41.27 180 top
C27  37.99,45.33 270 top
C28  23.24,52.2 90 top
C29  23.24,48.89 90 top
C30  28.07,43.05 270 top
C31  28.07,53.97 180 top
C32  25.91,42.8 270 top
C34  27.56,56.26 180 top
D1  26.51,19.21 90 top
IC1  63.35,41.27 270 top
IC2  59.82,58.58 0 top
IC3  39.45,16.59 90 top
IC5  42.62,45.1 270 top
IC30  42.86,32.32 90 bottom
J1  50.45,15.02 270 bottom
J2  36.51,29.15 90 top
J3  62.21,80.61 90 top
LED1  11.81,77.71 0 top
LED2  11.81,81.2 0 top
MOD1  40.62,65.68 0 top
R1  64.17,44.22 180 top
R2  66.82,41.26 90 top
R3  64.17,46.33 0 top
R4  36.91,21.83 180 top
R5  35.96,11.99 270 top
R6  41.51,11.43 270 bottom
R7  39.77,11.03 180 top
R8  63.66,31.43 180 top
R9  64.45,35.24 270 top
R10  22.38,16.67 180 top
R11  66.54,69.2 270 top
R12  31.97,15.08 180 top
R13  31.97,16.48 0 top
R14  31.97,13.68 180 top
R15  31.97,12.29 0 top
R16  22.38,23.18 0 top
R17  22.38,21.91 0 top
R18  40.96,39.53 180 top
R19  36.83,42.86 180 top
R20  64.87,69.22 270 top
R21  10.38,13.42 180 top
R22  10.38,37.55 180 top
R23  10.38,25.48 180 top
R24  10.38,49.61 180 top
R25  10.38,61.68 180 top
R26  10.38,73.74 180 top
R27  7.68,77.71 180 top
R28  7.68,81.2 180 top
R29  23.18,59.37 270 top
R30  23.18,56.2 90 top
R31  27.83,60.57 270 top
R34  45.56,16.54 270 top
R35  45.56,14.13 90 top
R36  47.88,7.75 0 top
R37  47.85,6.22 180 top
R38  34.53,18.8 180 top
R39  32.51,52.58 270 top
R40  32.51,49.4 90 top
R41  32.26,43.05 270 top
R42  30.23,43.05 90 top
SW1  72.25,70.84 270 top
SW2  9.11,7.39 90 top
SW3  9.11,31.52 90 top
SW4  9.11,19.45 90 top
SW5  9.11,43.58 90 top
SW6  9.11,55.65 90 top
SW7  9.11,67.71 90 top
T1  18.73,19.37 270 top
T2  22.38,19.37 270 top
T3  23.18,63.5 0 top
U$1  28.19,49.15 0 top
X1  57.48,48.09 0 top
X2  17.78,58.74 90 top
X3  17.78,50.8 90 top
X4  35.81,50.55 270 top
Y1  39.21,7.78 0 top

### Tracks (layer width: path | path; a pad name or v marks a point on that pad's centre or on a via)
+3V3  (via drill 0.3, 0.35)
  Top 0.15: R5.2 35.96,11.14 35.96,5.08 | 44.42,13.97 v42.86,13.97 | v35.06,17.68 34.85,17.89 34.85,21.51 | 37.31,22.54 36.04,22.54 | 37.39,22 R4.1
  Top 0.152: v42.86,13.97 v42.07,13.97 | v42.07,13.97 v42.07,13.18 | IC3.36 41.45,13.97 v42.07,13.97 | v43.1,17.22 v43.1,18.81 43.1,19.26 42.83,19.53 42.83,24.32 43.78,25.26 43.78,30.2 43.5,30.47 43.5,31.43 42.83,32.1 | v43.1,18.02 v43.1,17.22 | v43.1,17.22 42.97,17.09 IC3.6 | v38.26,21.03 v39.05,20.24 | v39.05,20.24 v38.26,20.24 v38.26,21.03 | v39.05,20.24 39.45,19.84 IC3.14 | v35.64,17.14 35.16,16.67 v35.16,16.51 | v35.06,17.68 v35.06,17.67 v35.64,17.14 | v35.64,17.14 36.04,17.14 36.12,17.07 36.72,17.07 IC3.22 | v38.26,21.03 38.26,21.67 38.1,21.83 R4.1 37.62,21.89 37.62,22.54 | 37.31,22.54 37.62,22.54 | 37.62,22.54 38.58,22.54 42.55,26.51 42.55,29.01 42.01,29.54 42.01,31.28 42.83,32.1 | 36.04,22.54 35.88,22.54 35.84,22.5 35.82,22.5 34.85,21.53 34.85,21.51 | R13.1 29.43,16.48 29.05,16.1 29.05,12.92 29.69,12.29 R15.1 31.12,11.49 31.46,11.14 35.96,11.14 | 44.78,9.98 44.29,9.49 44.29,1.43 44.45,1.27 | 44.78,9.98 45.56,10.76 R35.1 45.5,13.54 44.85,13.54 44.42,13.97 | R36.1 44.79,9.98 44.78,9.98 | 42.3,47.22 42.3,47.31 | IC5.14 41.65,39.69 R18.1 41.75,39.47 v41.75,33.34 42.83,32.26 42.83,32.1 | R34.1 45.56,18.52 46.4,19.36 51.18,19.36 | 35.96,5.08 35.96,1.27 35.56,1.27 | T2.2 22.23,20.31 | 22.23,20.31 T1.2 | 22.23,20.31 22.23,18.29 21.59,17.65 16.26,17.65
  Top 0.406: 41.26,46.18 C27.1 36.33,46.18 33.53,43.37 33.53,41.27 31.88,39.62 16.26,39.62 | 41.26,46.18 42.3,47.22 | 42.3,47.31 IC5.6 | IC5.14 41.65,45.78 41.26,46.18 | MOD1.12 30.82,56.98 30.1,56.26 C34.1 28.96,54.02 C31.1 28.83,53.89 U$1.6
  Top 0.508: R26.2 8.02,73.74 6.83,74.93 R27.2 R28.2 6.83,84.3 8.89,86.36 53.34,86.36 | T3.2 17.53,64.52 16.26,63.25 16.26,39.62 16.26,17.65 16.26,1.4 16.13,1.27 | 16.13,1.27 10.16,1.27 9.53,1.9 R21.2 | 16.13,1.27 35.56,1.27 44.45,1.27 50.16,1.27 51.18,2.29 51.18,19.36 51.18,24.51 52.51,25.84 70.29,25.84 72.39,27.94 72.39,53.34 | 72.39,53.34 72.39,56.61 | C5.1 72.39,56.61 | MOD1.12 40.64,58.68 | 40.64,58.68 47.62,58.68 | 47.62,58.68 MOD1.24 | MOD1.23 47.62,58.68 | 40.64,58.68 40.64,68.58 41.94,69.88 45.72,69.88 | 45.72,69.88 MOD1.32 | 72.39,56.61 72.39,77.47 | 72.39,77.47 68.58,77.47 66.54,75.43 R11.1 | 45.72,69.88 45.72,74.93 46.99,76.2 52.07,76.2 53.34,77.47 53.34,86.36 | 53.34,86.36 69.85,86.36 72.39,83.82 72.39,77.47 | 72.39,53.34
  Top 0.61: MOD1.32 60.7,69.88 63.48,72.67 63.48,78.07 J3.1 | R26.2 R25.2 R24.2 R22.2 R23.2 R21.2
  Top 0.711: 62.37,55.24 arc-90 IC2.3 62.13,56.2 64.8,56.2 C3.1 66.36,56.51 C4.1 C5.1
  Bottom 0.152: v35.64,17.14 C9.1 C10.1 35.64,17.24 v35.64,17.14 | 35.6,17.11 35.16,16.67 v35.16,16.51 | 35.6,17.11 v35.64,17.14 | v35.06,17.68 v35.06,17.67 v35.64,17.14 | 35.56,17.14 35.6,17.11 | C8.1 v39.05,20.24 v38.26,20.24 | C7.1 37.32,20.64 38.26,20.64 v38.26,20.24 | v43.1,17.22 v43.1,18.02 41.85,18.02 | v43.1,17.22 v43.1,18.81 | 41.85,18.02 C12.1 | v43.1,17.22 42.08,17.22 C11.1 41.77,17.94 41.85,18.02 | v42.07,13.97 41.29,13.97 C17.1 C16.1 | v38.26,20.24 v38.26,21.03 | v42.07,13.18 v42.07,13.97 | v42.07,13.97 v42.86,13.97 | C25.1 39.93,33.28 IC30.8 39.99,33.34 v41.75,33.34
+5V  (via drill 0.35)
  Top 0.406: IC1.4 66.66,40.32 R2.1
  Top 0.711: IC1.4 64.65,38.72 C1.1 64.79,38.72 64.79,36.43 R9.1
  other vias: 69.21,40 67.94,38.73 66.67,37.46 69.21,37.46 67.94,36.2
  pour Top (no thermals): 64.93,35.56 64.93,40.32 69.85,40.32 69.85,35.56
/EN  (via drill 0.35)
  Top 0.152: R17.2 23.39,21.75 v28.89,21.75 | v40.96,38.61 38.86,38.61 38.42,39.05 30.61,39.05 28.89,37.34 v28.89,23.02 | v47.12,38.26 48.26,38.26 48.34,38.18 | 48.34,38.18 48.9,37.62 48.9,35.41 48.1,34.62 v48.1,31.75 | 48.34,38.18 48.34,52.4 52.32,56.39 52.32,60.96 51.8,61.48 MOD1.26
  Bottom 0.152: v28.89,21.75 v28.89,23.02 | v47.12,38.26 46.25,38.26 45.57,38.95 45.57,41.4 44.81,42.16 41.71,42.16 40.96,41.41 v40.96,38.61 | v48.1,31.75 47.62,31.27 45.85,31.27 IC30.20
BUSY
  Top 0.152: MOD1.15 36.42,54.18 37.06,53.54 41.51,53.54 43.6,51.45 IC5.4
CLK  (via drill 0.35)
  Top 0.152: IC3.9 42.18,19.77 42.53,20.12 42.53,24.44 43.48,25.39 43.48,30.07 v42.84,30.7
  Bottom 0.152: v42.84,30.7 43.4,30.7 IC30.21
CMD  (via drill 0.35)
  Top 0.152: IC3.11 40.96,19.84 41.12,20 41.99,20 42.23,20.24 42.23,24.57 43.17,25.51 43.17,29.38 v42.84,29.71
  Bottom 0.152: v42.84,29.71 43.16,29.4 IC30.23
D0  (via drill 0.35)
  Top 0.152: IC3.5 43.26,16.59 43.66,16.99 43.66,19.13 43.13,19.65 43.13,24.19 44.08,25.14 44.08,30.32 v44.08,31.97 44.08,31.28
  Bottom 0.152: v44.08,31.97 44.11,32 IC30.19
D1  (via drill 0.35)
  Top 0.152: IC3.4 42.68,16.09 42.88,16.29 43.38,16.29 43.96,16.86 43.96,19.26 43.44,19.78 43.44,24.07 44.63,25.26 44.63,28.7 44.63,29.79 | 44.63,29.79 v44.66,30.04 arc90 44.63,30.02 44.63,29.79
  Bottom 0.152: v44.66,30.04 44.86,30.05 IC30.22
D2  (via drill 0.35)
  Top 0.152: 35.16,22.81 35.16,22.86 | 35.16,22.81 34.15,21.8 34.15,16.07 34.56,15.65 36.68,15.65 IC3.25 | 35.16,22.81 35.51,23.16 38.34,23.16 41.32,26.14 v41.32,29.33
  Bottom 0.152: v41.32,29.33 40.01,29.33 IC30.2
D3  (via drill 0.35)
  Top 0.152: IC3.23 36.04,16.59 35.4,15.95 34.69,15.95 34.45,16.19 34.45,21.67 35.62,22.85 38.45,22.85 41.83,26.22 41.83,28.7 41.95,28.7 41.95,28.77
  Top 0.254: v41.88,28.77 41.95,28.7
  Bottom 0.152: IC30.1 41.87,28.75 v41.88,28.77
D+  (via drill 0.3)
  Top 0.15: IC3.2 45.56,15.09 | 45.56,15.09 46.25,15.09 v46.51,14.83 | R35.2 45.56,15.09
  Top 0.152: IC3.2 arc90 IC3.2
  Bottom 0.15: J1.3 46.7,15.02 v46.51,14.83
D-  (via drill 0.3)
  Top 0.15: 42.19,15.56 45.62,15.56 | 45.62,15.56 46.29,15.56 v46.51,15.78 | R34.2 45.62,15.83 45.62,15.56
  Top 0.152: IC3.3 arc90 42.19,15.56
  Bottom 0.15: J1.2 46.63,15.67 v46.51,15.78
DCLK
  Top 0.152: MOD1.17 39.22,54.81 39.7,54.33 41.94,54.33 41.96,54.36 44.9,51.42 IC5.2
DIN
  Top 0.152: IC5.3 44.25,51.44 41.71,53.97 38.33,53.97 37.8,54.51 37.82,54.53 MOD1.16
GND  (via drill 0.3, 0.35, 0.4, 0.5, 0.55)
  Top 0.152: v40.08,23.02 C14.2 C13.2 v41.2,23.02 | 40.64,23.57 v40.64,23.65 | v40.08,23.02 40.64,23.57 | v41.2,23.02 40.64,23.57 | v44.37,11.11 v44.37,12.22 | v44.37,12.22 C18.2 C19.2 v44.37,11.11 | v44.37,11.11 v44.93,11.67 v44.37,12.22 | v40.08,23.02 v41.2,23.02 | IC3.28 37.45,14.59 37.78,14.92 v37.78,15.16 | R12.2 v29.94,15.08 | R14.2 v29.94,13.68 | 40.32,43.81 40.35,43.79 | R10.2 v20.32,16.67 | R16.2 v24.29,23.18 | C15.2 35.62,20.43
  Top 0.254: C23.2 26.35,59.6 v26.35,58.42
  Top 0.406: R1.2 63.24,43.74 63.24,41.27 | 40.24,5.32 40.24,6.91 41.99,6.91 | 38.18,8.49 37.7,8.49 | 37.7,8.49 36.75,8.49 | 37.54,9.76 37.7,9.76 37.7,8.49 | R37.2 45.85,6.22 v45.72,6.35 | 40.32,43.81 39.66,44.48 C27.2 36.54,44.48 v36.51,44.45 | 40.35,43.79 IC5.12 | R30.1 21.68,55.35 v21.65,55.37 | C32.2 26.31,42.2 C30.2 v28.07,40.51 v27.05,40.51 v26.04,40.51 26.04,41.67 C32.2 | C32.2 24.4,41.8 v24.38,41.78 | U$1.7 v27.56,50.55 v26.42,50.55 v25.27,50.55 | MOD1.13 33.55,56.52 v32.13,56.52 v32.13,55.5 | C31.2 v25.78,53.97 | C34.2 25.78,55.88 v25.78,53.97 | v25.78,53.97 v24.64,53.97
  Top 0.61: SW1.B v74.25,70.76 SW1.B' | J3.3 J3.5 v66.66,80.61 | J3.9 v66.66,83.15 | MOD1.1 33.17,74.08 33.32,73.94 | MOD1.35 50.28,73.94 48.24,73.94 | SW2.B v7.11,7.38 SW2.B' | SW3.B v7.11,31.52 SW3.B' | SW4.B v7.11,19.45 SW4.B' | SW5.B v7.11,43.58 SW5.B' | SW6.B v7.11,55.64 SW6.B' | SW7.B v7.11,67.71 SW7.B'
  Top 0.686: IC1.2 v60.17,41.27 | 59.82,58.84 v58.9,59.69
  Top 0.711: IC1.2 63.24,41.27 63.24,38.72 C1.2 62.93,38.72 62.93,36.73 v62.71,36.51 | v58.9,41.29 58.9,41.26 C2.2 57.63,41.26 v57.63,42.54 57.63,46.4 X1.2 59.78,48.55 C6.2 59.82,53.18 IC2.2 59.82,58.84 59.82,59.62 arc-90 60.13,59.92 | C22.2 v67.63,32.86 | C22.2 66.25,33.92 v66.2,33.97 | C22.2 v66.25,31.65 66.2,31.59
  Bottom 0.152: 40.01,23.02 v40.08,23.02 40.64,23.02 | 40.16,23.26 40.08,23.26 | C25.2 38.76,31.35 IC30.5 | IC30.11 39.25,35.25 39.01,35.48
  Bottom 0.406: J1.SHELL3 50.7,11.27 | J1.5 46.74,13.72 46.67,13.65 v46.67,12.7 | 38.12,18.77 38.12,18.82 38.1,18.85 38.29,18.85 C8.2 40.03,19.06 40.03,19.08 | v32.13,56.52 v32.13,57.53
  other vias: 60.17,42.54 58.9,42.54 60.17,43.81 58.9,43.81 57.63,43.81 55.09,59.69 55.09,61.59 55.09,63.5 55.09,65.41 56.99,59.69 56.99,61.59 56.99,63.5 56.99,65.41 58.9,63.5 58.9,65.41 60.8,63.5 60.8,65.41 62.71,65.41 62.71,63.5 64.61,65.41 64.61,63.5 64.61,61.59 62.71,61.59 62.71,59.69 60.8,59.69 63.28,41.27 66.52,61.59 66.52,63.5 66.52,65.41 41.12,16.11 39.45,16.11 39.45,17.07 38.58,17.07 38.58,16.11 38.58,15.16 43.42,13.26 44.6,34.9 36.25,19.81 32.66,22.86 38.76,35.89 34.62,34.65 32.38,61.59 39.37,61.59 39.37,68.58 32.38,68.58 29.21,73.66 25.4,73.66 21.59,73.66 17.14,73.66 13.34,74.3 9.52,74.93 9.52,76.2 13.34,76.2 17.14,76.83 21.59,76.83 25.4,76.83 9.52,79.38 13.34,79.38 17.14,79.38 21.59,79.38 25.4,79.38 8.89,83.19 13.34,83.19 17.14,82.55 21.59,82.55 25.4,82.55 41.91,71.12 44.45,71.12 25.4,85.09 13.34,85.09 72.39,85.72 44.45,74.93 38.73,74.93 46.99,71.12 48.9,71.12 48.9,73.66 46.99,73.66 52.7,74.93 54.61,80.64 57.79,80.64 57.79,85.09 54.61,85.09 69.85,79.38 69.85,83.19 62.23,80.64 58.42,76.2 62.23,76.2 62.23,73.66 58.42,73.66 55.24,71.12 59.69,71.12 67.94,70.48 67.94,74.93 71.12,57.78 71.12,64.77 62.87,68.58 52.07,67.31 52.07,64.77 56.52,50.8 53.98,55.24 50.8,52.07 50.16,43.18 51.44,32.38 46.99,27.3 44.45,23.5 44.45,20.96 46.99,20.96 53.34,27.94 57.79,31.75 71.12,55.24 71.12,48.89 71.12,41.91 71.12,34.29 50.16,20.96 57.15,27.3 64.13,29.85 46.99,18.42 46.36,10.16 45.72,2.54 49.53,2.54 43.18,2.54 43.18,8.89 37.47,2.54 37.59,11.05 36.7,8.64 36.7,6.98 36.7,5.46 39.37,5.46 41.78,5.46 41.78,6.98 41.78,8.64 34.29,2.54 34.29,9.53 17.27,2.41 17.78,16.51 24.77,17.78 27.3,15.24 28.07,12.06 30.48,40.64 17.78,40.64 17.78,45.09 23.5,45.09 23.5,40.64 39.37,42.54 40.64,42.54 40.64,45.09 39.37,45.09 34.29,51.43 34.29,53.97 30.48,54.61 19.05,53.97 21.59,58.42 19.05,58.42 19.05,63.5 26.04,62.86 28.57,62.86 31.12,19.05 37.47,24.13 32.38,26.67 34.93,30.48 40.01,27.3 32.38,31.11 32.38,35.56 43.18,33.66 38.1,37.46 48.9,33.02 39.05,21.75 76.2,34.29 76.2,41.91 76.2,49.53 76.2,58.42 76.2,67.31 76.2,76.2 76.83,85.72 49.02,15.09 50.11,9.12 76.2,26.04 69.21,27.3 17.78,12.7 13.97,2.54 13.97,12.7 15.24,22.86 15.24,33.02 15.24,43.81 15.24,56.52
  pour Top: 57,44.44 60.81,44.44 60.81,40.95 57,40.95
  pour Top (no thermals): 67.79,66.99 67.79,60.01 62.39,60.01 62.39,58.42 53.82,58.42 53.82,66.99
  pour Top (isolate 1.016): 67.79,60.01 62.39,60.01 62.39,58.42 67.79,58.42
  pour Bottom: 38.26,20.24 39.05,20.24 39.05,21.03 38.26,21.03
  pour Top (isolate 0.203, rank 2): 78.1,24.77 51.44,24.77 51.44,1.27 6.35,1.27 6.35,86.36 78.1,86.36
  pour Bottom (rank 2): 0.63,87 0.63,0.64 51.44,0.64 51.44,24.77 78.1,24.77 78.1,87
IN  (via drill 0.35)
  Top 0.152: D1.1 29.21,18.26 30.16,19.21 v30.16,21.75 | v41.16,37.66 39.48,37.67 39.17,37.67 38.26,38.58 31.75,38.58 30.16,36.99 v30.16,23.02 | v48.16,35.62 48.26,35.56 48.26,36.99 47.79,37.46 v46.36,37.46 46.36,38.73 47.75,40.13 47.75,52.58 51.82,56.64 51.82,59.69 51.42,60.08 MOD1.25 49.31,60.08 49.3,60.07 48.82,60.55 48.82,61.77 49.25,62.2 52.15,62.2 52.86,61.49 52.86,56.16 49.17,52.48 49.17,42.11 50.14,41.15 50.14,31.27 47.6,28.73 v47.04,28.73
  Bottom 0.152: v30.16,21.75 v30.16,23.02 | v46.36,37.46 v46.35,37.46 45.51,37.49 45.14,37.87 45.14,41.3 44.6,41.83 42.09,41.83 41.61,41.35 41.61,38.11 v41.16,37.66 | IC30.14 46.15,35.24 47.79,35.24 v48.16,35.62 | IC30.24 47.02,28.75 v47.04,28.73
LED0  (via drill 0.35)
  Top 0.254: LED1.C 26.04,77.71 28.78,74.97 34.96,74.97 v40.26,69.67 | MOD1.29 50.38,65.72 44.16,65.72 v41.5,68.38
  Bottom 0.254: v41.5,68.38 40.26,69.62 v40.26,69.67
LED1  (via drill 0.35)
  Top 0.254: LED2.C 13.32,81.19 24.77,81.19 26.67,79.29 26.67,78.11 29.21,75.56 35.76,75.56 v40.95,70.38 | v42.17,69.08 44.17,67.08 MOD1.30
  Bottom 0.254: v42.17,69.08 40.95,70.31 v40.95,70.38
N$1
  Top 0.406: R1.1 64.79,43.74 64.79,42.22 | 64.79,42.19 64.79,42.22 | 64.79,42.22 IC1.5
N$2
  Top 0.406: R2.2 66.83,45.8 66.35,46.33 R3.2
N$3
  Top 0.406: IC1.1 62.06,45.85 62.54,46.33 R3.1
N$5  (via drill 0.3)
  Top 0.406: R36.2 48.9,7.91 | 48.9,7.91 v48.9,8.89 | R37.1 48.9,6.42 48.9,7.91
  Bottom 0.406: J1.4 48.66,14.37 48.9,14.13 v48.9,8.89
N$8
  Top 0.152: D1.2 27.29,19.84 27.05,19.84 27.08,19.81 27.08,19.41 26.54,18.87 26.54,17.53 27.3,16.76 28.57,16.76 29.72,17.91 32.69,17.91 R38.2
N$9  (via drill 0.35)
  Top 0.152: v49.46,34.62 49.45,34.56 49.45,40.11 v49.02,40.54 | v47.14,40.54 45.03,40.54 44.9,40.68 IC5.19
  Bottom 0.152: v49.02,40.54 v47.14,40.54 | v49.46,34.62 49.44,34.6 IC30.15
N$10
  Top 0.406: C28.1 19.08,51.35 X3.2
N$11
  Top 0.406: C28.2 24.17,53.05 25.27,51.94 U$1.8
N$12
  Top 0.406: C29.2 29.17,49.74 30.1,50.67 U$1.5 30.1,52.96 30.61,53.47 32.47,53.47 R39.1
N$13
  Top 0.406: R42.2 C30.1 | C30.1 26.01,43.9 C32.1 | U$1.2 27.56,45.47 28.07,44.96 C30.1
N$14
  Top 0.406: U$1.4 30.1,49.28 31.08,50.25 R40.2 R39.2
N$15
  Top 0.406: U$1.3 28.83,45.47 29.21,45.09 30.99,45.09 31.24,44.83 31.24,42.16 | 31.24,42.16 30.27,42.16 R42.1 | 31.24,42.16 32.35,42.16 R41.2
N$16
  Top 0.406: C29.1 18.89,48.04 X3.1
N$17
  cutout Top: 30.48,76.2 52.07,76.2 53.34,77.47 53.34,86.36 27.3,86.36 27.3,79.38
N$18
  cutout Bottom: 27.3,83.19 27.3,79.38 30.48,76.2 46.36,76.2 46.99,76.83 50.8,76.83 50.8,82.55 50.8,83.82 27.3,83.82
N$27
  Top 0.152: R4.2 36.34,21.75 36.75,21.75 36.91,21.59 36.91,20.65 C15.1 36.92,19.59 37.19,19.32 IC3.18
N$28
  Top 0.152: R5.1 35.96,13.33 36.71,14.09 IC3.27
N$31  (via drill 0.3)
  Top 0.152: IC3.35 40.95,13.26 v41.27,12.94
  Bottom 0.152: v41.27,12.94 41.27,12.32 arc90 R6.1
N$34  (via drill 0.35)
  Top 0.406: R8.2 59.2,31.43 58.24,30.48 54.61,30.48 48.26,24.13 v48.26,20.5
  Bottom 0.406: J1.1 48.7,16.32 48.9,16.51 48.9,17.78 48.26,18.42 v48.26,20.5
N$35
  Top 0.152: 39.12,11.11 R7.2 39.2,11.03 | 39.12,11.11 39.12,11.65 39.45,11.99 IC3.32 | 38.66,7.38 38.56,7.38 Y1.1 38.2,6.93 39.21,7.94 39.21,9.92 | 39.21,9.92 39.21,11.02 39.2,11.03 | 39.2,11.03 39.12,11.11 | C20.2 39.21,9.92
N$36
  Top 0.152: IC3.33 39.95,11.96 40.24,11.67 40.24,11.21 R7.1 arc90 40.31,10.93 40.31,9.92 | 40.31,9.92 Y1.3 | C21.1 40.31,9.92
  Top 0.254: 40.19,8.83 Y1.3
N$37
  Top 0.711: R8.1 64.51,32.81 C22.1 64.55,34.29 R9.2
N$38  (via drill 0.35)
  Top 0.152: J2.5 37.43,33.55 38.18,34.3 v38.8,34.3
  Bottom 0.152: v38.8,34.3 38.92,34.3 39.27,33.95 IC30.9
N$39
  Top 0.152: R18.2 40.43,39.85 40.8,39.85 41,40.04 IC5.13
N$40
  Top 0.254: IC5.11 39.62,41.27 C26.1 R19.1
N$41  (via drill 0.35)
  Top 0.152: IC5.16 42.95,40.56 43.42,40.08 43.42,35 45.16,33.27 v47.01,33.27
  Bottom 0.152: v47.01,33.27 45.81,33.27 IC30.17
N$42  (via drill 0.35)
  Top 0.152: v47.01,32.47 46.87,32.61 45.54,32.61 45.41,32.61 45.05,32.96 45.03,32.96 42.55,35.45 42.55,40.48 42.3,40.73 IC5.15
  Bottom 0.152: v47.01,32.47 46.83,32.65 IC30.18
N$43  (via drill 0.35)
  Top 0.152: J2.1 38.35,29.15 v38.42,29.21
  Bottom 0.152: v38.42,29.21 39.05,29.85 39.05,30.48 39.27,30.7 IC30.4
N$44  (via drill 0.35)
  Top 0.152: v39.92,36.6 36.73,36.63 J2.8
  Bottom 0.152: IC30.12 39.92,36.55 v39.92,36.6
N$45  (via drill 0.35)
  Top 0.152: J2.2 39.77,30.25 v41.12,31.59
  Bottom 0.152: v41.12,31.59 40.71,32 IC30.6
N$46
  Top 0.152: T1.3 19.87,18.26 20.8,18.26 21.37,18.83 T2.1 19.23,19.34 18.73,19.84 18.73,21.43 19.21,21.91 R17.1
N$48
  Top 0.61: R20.2 66.53,68.36 R11.2 70.02,68.35 70.25,68.12 SW1.A' SW1.A
N$49
  Top 0.152: R10.1 23.4,16.84 T2.3 23.4,18.96 23.65,19.21 D1.3
N$50
  Top 0.61: J3.4 56.81,79.34 54.91,77.43 54.91,74.89 52.69,72.67 52.67,72.68 MOD1.34
N$52
  Top 0.61: MOD1.31 61.2,68.48 62.85,70.13 64.8,70.13 | 64.8,70.13 R20.1 | J3.10 60.31,83.19 60.31,84.1 60.94,84.73 67.29,84.73 68.24,83.78 68.24,78.7 64.75,75.21 64.75,70.18 64.8,70.13
N$53
  Top 0.61: J3.2 57.45,78.07 56.5,77.11 56.5,74.57 53.21,71.28 MOD1.33
N$54
  Top 0.254: R27.1 LED1.A
N$55
  Top 0.254: C23.1 R31.1 28.71,61.42 29.53,62.23 29.53,62.55 29.84,62.86 30.8,62.86 MOD1.9
N$61
  Top 0.254: R28.1 LED2.A
N$63
  Top 0.406: X2.1 18.57,57.05 R30.2 R29.2
N$64
  Top 0.406: MOD1.8 25.89,64.28 25.65,64.52 T3.3
N$65
  Top 0.406: R29.1 23.18,62.46 T3.1
N$68
  cutout Top: 18.16,10.79 33.15,10.79 33.15,1.9 18.16,1.9
  cutout Bottom: 33.15,10.79 18.16,10.79 18.16,1.9 33.15,1.9
NCD
  Top 0.152: R13.2 R12.1 IC3.26
NCD1
  Top 0.152: T1.1 17.72,21.53 19.21,23.02 21.38,23.02 R16.1 21.59,23.23 21.59,24.13 21.75,24.29 25.88,24.29 27.81,22.35 30.61,22.35 30.99,22.73 30.99,28.32 35.05,32.38 36.25,32.38 J2.4 36.22,32.54
NEXT
  Top 0.152: IC5.20 45.55,42.98 46.97,44.4 46.97,52.53 46.41,53.09 46.41,56.4 MOD1.22
PLAY
  Top 0.152: 35.2,57.35 MOD1.14 35.02,54.63 36.42,53.24 41.25,53.24 42.95,51.54 IC5.5
PREV
  Top 0.152: MOD1.20 43.42,53.63 45.55,51.51 IC5.1
PWM  (via drill 0.35)
  Top 0.254: C26.2 R19.2 v34.54,42.86 | v34.54,45.97 37.57,49 IC5.10
  Bottom 0.254: v34.54,42.86 v34.54,45.97
PWR
  Top 0.152: 36.71,17.62 arc-90 IC3.21 36.01,17.59 35.61,17.98 35.61,18.67 arc90 R38.1
RESET
  Top 0.152: MOD1.21 44.82,53.02 46.43,51.41 46.43,44.6 45.8,43.97 44.38,43.97 43.6,43.18 IC5.17
SDCS  (via drill 0.35)
  Top 0.152: 44.72,35.96 v44.7,35.93 44.7,39.12 44.25,39.57 IC5.18
  Bottom 0.152: v44.7,35.93 44.74,35.9 IC30.13
SDDI  (via drill 0.35)
  Top 0.152: J2.3 37.38,31.35 37.62,31.59 37.62,32.37 v37.56,32.44
  Bottom 0.152: v37.56,32.44 39.13,32.44 39.35,32.65 IC30.7
SDDO  (via drill 0.35)
  Top 0.152: J2.7 37.43,35.75 v38.17,35
  Bottom 0.152: v38.17,35 38.6,35 38.75,34.86 39.03,34.86 39.29,34.6 IC30.10
SPK+
  Top 0.406: IC5.7 41.55,49.1 41.55,50.04 40.79,50.8 35.69,50.8 | 35.69,50.8 35.71,50.83 X4.1 | R40.1 32.8,48.55 35.05,50.8 35.69,50.8
SPK-
  Top 0.406: IC5.8 41,49.81 40.64,50.16 37.08,50.16 X4.2 32.26,45.34 R41.1
STANDBY
  Top 0.152: 30.1,59.82 30.37,60.08 MOD1.11 30.55,59.82 29.59,59.82 29.08,59.31 29.08,58.55 28.19,57.66 25.54,57.66 25.13,57.25 25.13,56.5 24.77,56.13 19.43,56.13 16.74,53.44 16.74,47.65 18.16,46.23 26.17,46.23 U$1.1
TASTE0
  Top 0.254: MOD1.7 15.84,65.68 15.24,65.09 15.24,60.01 14.29,59.05 14.29,13.97 13.65,13.33 11.55,13.33 11.23,13.02
  Top 0.61: SW2.A SW2.A' 11.23,10.9 11.23,13.02 R21.1
TASTE1
  Top 0.254: MOD1.5 14.83,68.48 13.97,67.63 13.97,60.64 13.02,59.69 13.02,38.1 12.38,37.46 11.32,37.46 R22.1 11.23,35.03 SW3.A'
  Top 0.61: SW3.A SW3.A'
TASTE2
  Top 0.254: MOD1.6 15.65,67.08 14.61,66.04 14.61,60.33 13.65,59.37 13.65,26.67 12.38,25.4 11.32,25.4 R23.1
  Top 0.61: SW4.A SW4.A' 11.23,22.97 R23.1
TASTE3
  Top 0.254: MOD1.4 14.32,69.88 13.34,68.9 13.34,60.96 12.38,60.01 12.38,49.85 12.07,49.53 11.98,49.61 R24.1
  Top 0.61: SW5.A 11.11,44.21 | 11.11,44.21 11.11,46.75 | 11.11,46.75 SW5.A' | R24.1 11.23,46.88 11.11,46.75 | 11.18,44.29 11.11,44.21
TASTE4
  Top 0.254: MOD1.3 13.5,71.28 12.7,70.48 12.7,62.23 12.07,61.59 11.23,61.59
  Top 0.61: R25.1 11.23,61.59 11.23,59.16 SW6.A' SW6.A 11.18,52.18 11.18,51.36 11.38,51.56 | 30.71,71.4 MOD1.3
TASTE5
  Top 0.254: MOD1.2 13.68,72.68 12.7,73.66 11.32,73.66 R26.1
  Top 0.61: SW7.A 11.11,70.88 | 11.11,70.88 SW7.A' | R26.1 11.23,71 11.11,70.88
V+  (via drill 0.35)
  Top 0.254: R31.2 28.82,59.72 29.87,60.77 32.38,60.77 32.78,60.38 v39.4,60.38 | v41.43,60.45 45.74,60.45 48.87,63.58 48.88,63.57 51.37,63.57 53.62,61.32 53.62,57.68 55.73,55.57 X1.1
  Top 0.711: 55.76,47.99 C2.1 55.72,41.22 55.72,40 56.36,39.37 59.53,39.37 60.48,40.32 IC1.3 | 55.76,47.99 X1.1 | 55.76,47.99 57.88,50.12 C6.1 57.88,53.46 arc90 57.64,53.7 57.64,54.63 arc-90 57.51,54.76 IC2.1
  Bottom 0.254: v41.43,60.45 39.47,60.45 v39.4,60.38
  other vias: 56.04,37.62 58.1,37.62 60.17,37.62 56.04,35.56 58.1,35.56 60.17,35.56 60.17,33.5 58.1,33.5 56.04,33.5
  pour Top (no thermals): 55.24,40 61.83,40 61.83,32.62 55.24,32.62
VDD18
  Top 0.152: IC3.13 39.95,20.65 C14.1 C13.1
VDD18PLL
  Top 0.152: IC3.34 40.45,12.73 40.96,12.22 C18.1 C19.1
WP
  Top 0.152: R14.1 R15.2 33.08,12.03 37.81,12.03 38.45,12.67 IC3.30

### Text on the board
Top: P0 | P1 | S6 | S5 | S4 | S3 | Hergestellt aus / biologisch / gehaltenen / Halbleitern... | S2 | S1 | FHNW Pro4E 18 / Team3 / Prototyp 1.0 / Top Layer
Bottom: FHNW Pro4E 18 / Team3 / Prototyp 1.0 / Top Layer